# Altium schematic sheet MCU.SchDoc
size A4; SheetNumber: 5; SheetTotal: 7
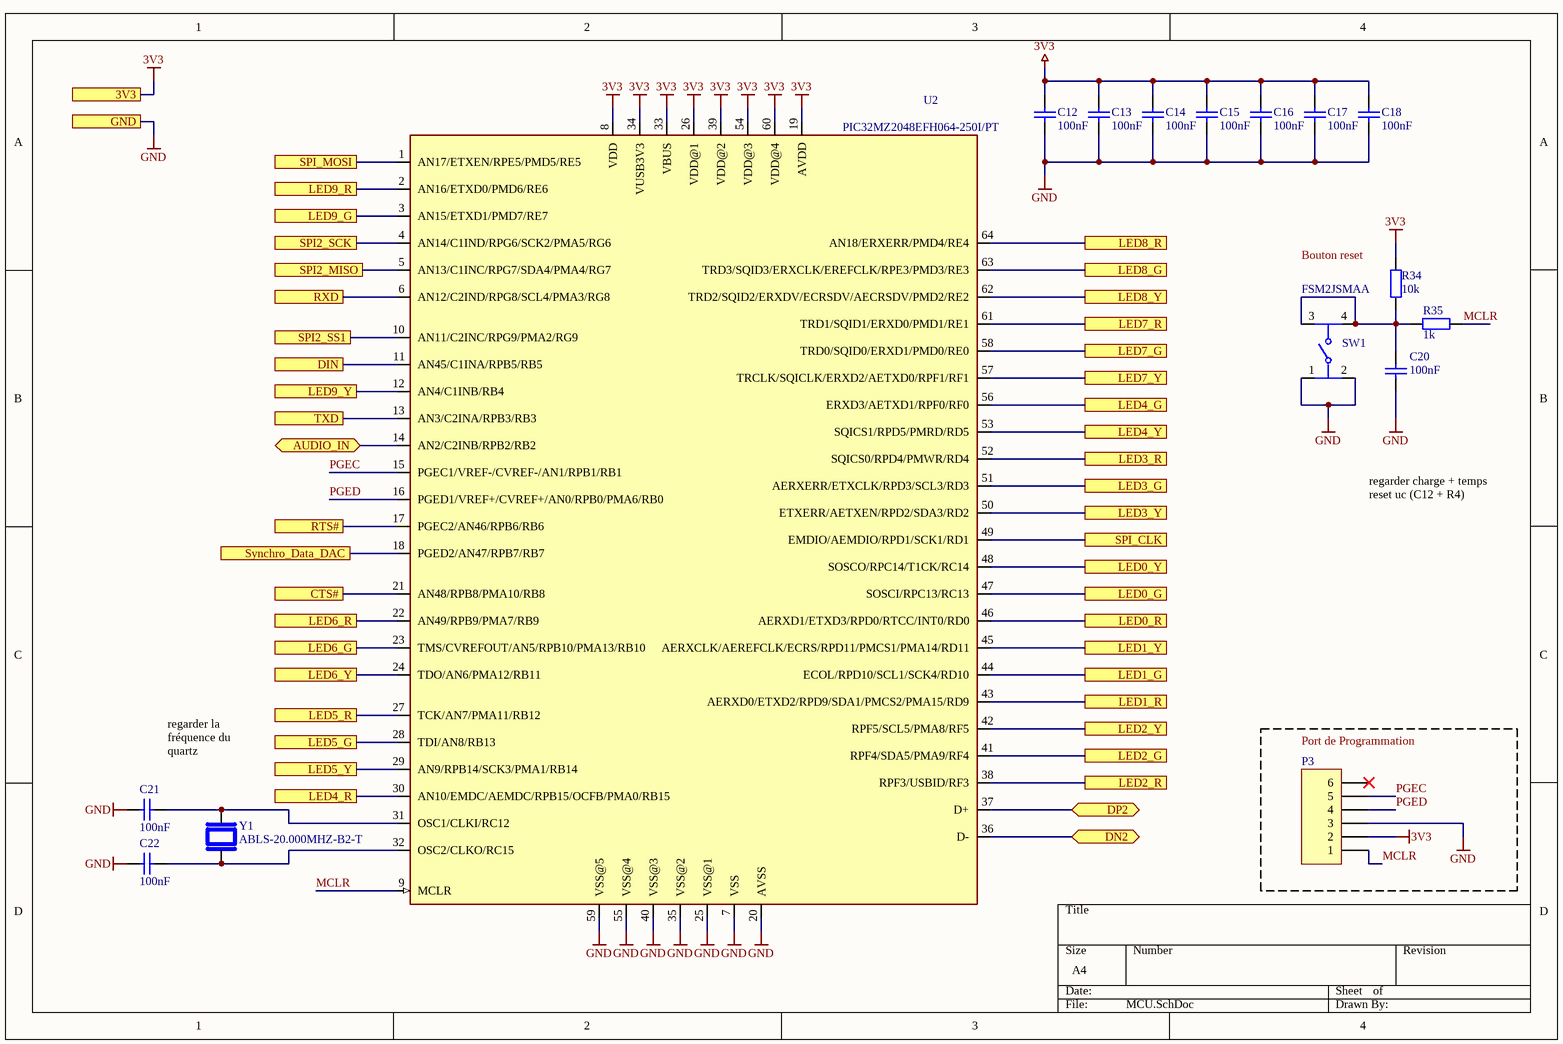
[diagram p0: MCU.SchDoc]

## Parts
C12  100nF  [C0805]
C13  100nF  [C0805]
C14  100nF  [C0805]
C15  100nF  [C0805]
C16  100nF  [C0805]
C17  100nF  [C0805]
C18  100nF  [C0805]
C20  100nF  [C0805]
C21  100nF  [C0805]
C22  100nF  [C0805]
P3  76384-406LF  [HDR1X6]  (value not drawn)
R34  10k  [RESC2012X06M]
R35  1k  [RESC2012X06M]
SW1  FSM2JSMAA  [FP-FSM2JSMAA-MFG]
U2  PIC32MZ2048EFH064-250I/PT  [QFP50P1200X1200X120-64N]
Y1  ABLS-20.000MHZ-B2-T  [XTAL_ABLS-20.000MHZ-B2-T]

## Blocks framed on the sheet
Port de Programmation: P3

## Ports
3V3, AUDIO_IN (bidir), CTS#, DIN, DN2 (bidir), DP2 (bidir), GND, LED0_G, LED0_R, LED0_Y, LED1_G, LED1_R, LED1_Y, LED2_G, LED2_R, LED2_Y, LED3_G, LED3_R, LED3_Y, LED4_G, LED4_R, LED4_Y, LED5_G, LED5_R, LED5_Y, LED6_G, LED6_R, LED6_Y, LED7_G, LED7_R, LED7_Y, LED8_G, LED8_R, LED8_Y, LED9_G, LED9_R, LED9_Y, RTS#, RXD, SPI2_MISO, SPI2_SCK, SPI2_SS1, SPI_CLK, SPI_MOSI, Synchro_Data_DAC, TXD

## Nets
3V3: C12.1 C13.1 C14.1 C15.1 C16.1 C17.1 C18.1 P3.2 R34.1 U2.8(VDD) U2.19(AVDD) U2.26(VDD@1) U2.33(VBUS) U2.34(VUSB3V3) U2.39(VDD@2) U2.54(VDD@3) U2.60(VDD@4) ; port 3V3
GND: C12.2 C13.2 C14.2 C15.2 C16.2 C17.2 C18.2 C20.1 C21.2 C22.2 P3.3 SW1.1 SW1.2 U2.7(VSS) U2.20(AVSS) U2.25(VSS@1) U2.35(VSS@2) U2.40(VSS@3) U2.55(VSS@4) U2.59(VSS@5) ; port GND
AUDIO_IN: U2.14(AN2/C2INB/RPB2/RB2) ; port AUDIO_IN
CTS#: U2.21(AN48/RPB8/PMA10/RB8) ; port CTS#
DIN: U2.11(AN45/C1INA/RPB5/RB5) ; port DIN
DN2: U2.36(D-) ; port DN2
DP2: U2.37(D+) ; port DP2
LED0_G: U2.47(SOSCI/RPC13/RC13) ; port LED0_G
LED0_R: U2.46(AERXD1/ETXD3/RPD0/RTCC/INT0/RD0) ; port LED0_R
LED0_Y: U2.48(SOSCO/RPC14/T1CK/RC14) ; port LED0_Y
LED1_G: U2.44(ECOL/RPD10/SCL1/SCK4/RD10) ; port LED1_G
LED1_R: U2.43(AERXD0/ETXD2/RPD9/SDA1/PMCS2/PMA15/RD9) ; port LED1_R
LED1_Y: U2.45(AERXCLK/AEREFCLK/ECRS/RPD11/PMCS1/PMA14/RD11) ; port LED1_Y
LED2_G: U2.41(RPF4/SDA5/PMA9/RF4) ; port LED2_G
LED2_R: U2.38(RPF3/USBID/RF3) ; port LED2_R
LED2_Y: U2.42(RPF5/SCL5/PMA8/RF5) ; port LED2_Y
LED3_G: U2.51(AERXERR/ETXCLK/RPD3/SCL3/RD3) ; port LED3_G
LED3_R: U2.52(SQICS0/RPD4/PMWR/RD4) ; port LED3_R
LED3_Y: U2.50(ETXERR/AETXEN/RPD2/SDA3/RD2) ; port LED3_Y
LED4_G: U2.56(ERXD3/AETXD1/RPF0/RF0) ; port LED4_G
LED4_R: U2.30(AN10/EMDC/AEMDC/RPB15/OCFB/PMA0/RB15) ; port LED4_R
LED4_Y: U2.53(SQICS1/RPD5/PMRD/RD5) ; port LED4_Y
LED5_G: U2.28(TDI/AN8/RB13) ; port LED5_G
LED5_R: U2.27(TCK/AN7/PMA11/RB12) ; port LED5_R
LED5_Y: U2.29(AN9/RPB14/SCK3/PMA1/RB14) ; port LED5_Y
LED6_G: U2.23(TMS/CVREFOUT/AN5/RPB10/PMA13/RB10) ; port LED6_G
LED6_R: U2.22(AN49/RPB9/PMA7/RB9) ; port LED6_R
LED6_Y: U2.24(TDO/AN6/PMA12/RB11) ; port LED6_Y
LED7_G: U2.58(TRD0/SQID0/ERXD1/PMD0/RE0) ; port LED7_G
LED7_R: U2.61(TRD1/SQID1/ERXD0/PMD1/RE1) ; port LED7_R
LED7_Y: U2.57(TRCLK/SQICLK/ERXD2/AETXD0/RPF1/RF1) ; port LED7_Y
LED8_G: U2.63(TRD3/SQID3/ERXCLK/EREFCLK/RPE3/PMD3/RE3) ; port LED8_G
LED8_R: U2.64(AN18/ERXERR/PMD4/RE4) ; port LED8_R
LED8_Y: U2.62(TRD2/SQID2/ERXDV/ECRSDV/AECRSDV/PMD2/RE2) ; port LED8_Y
LED9_G: U2.3(AN15/ETXD1/PMD7/RE7) ; port LED9_G
LED9_R: U2.2(AN16/ETXD0/PMD6/RE6) ; port LED9_R
LED9_Y: U2.12(AN4/C1INB/RB4) ; port LED9_Y
MCLR: P3.1 R35.1 U2.9(MCLR)
PGEC: P3.5 U2.15(PGEC1/VREF-/CVREF-/AN1/RPB1/RB1)
PGED: P3.4 U2.16(PGED1/VREF+/CVREF+/AN0/RPB0/PMA6/RB0)
RTS#: U2.17(PGEC2/AN46/RPB6/RB6) ; port RTS#
RXD: U2.6(AN12/C2IND/RPG8/SCL4/PMA3/RG8) ; port RXD
SPI2_MISO: U2.5(AN13/C1INC/RPG7/SDA4/PMA4/RG7) ; port SPI2_MISO
SPI2_SCK: U2.4(AN14/C1IND/RPG6/SCK2/PMA5/RG6) ; port SPI2_SCK
SPI2_SS1: U2.10(AN11/C2INC/RPG9/PMA2/RG9) ; port SPI2_SS1
SPI_CLK: U2.49(EMDIO/AEMDIO/RPD1/SCK1/RD1) ; port SPI_CLK
SPI_MOSI: U2.1(AN17/ETXEN/RPE5/PMD5/RE5) ; port SPI_MOSI
Synchro_Data_DAC: U2.18(PGED2/AN47/RPB7/RB7) ; port Synchro_Data_DAC
TXD: U2.13(AN3/C2INA/RPB3/RB3) ; port TXD
NetC20_2: C20.2 R34.2 R35.2 SW1.3 SW1.4
NetC21_1: C21.1 U2.31(OSC1/CLKI/RC12) Y1.2
NetC22_1: C22.1 U2.32(OSC2/CLKO/RC15) Y1.1

Not connected (* = marked no-connect by the designer): P3 6*

## Notes on the sheet
- (near R34) Bouton reset
- regarder charge + temps reset uc (C12 + R4)
- regarder la fréquence du quartz

## Library data of the parts
C12-C18 = Cap: Capacitor; Published: 8-Jun-2000; LatestRevisionDate: 17-Jul-2002; LatestRevisionNote: Re-released for DXP Platform.; PackageReference: RAD-0.3; Publisher: Altium Limited; PackageDescription: Radial Cap, Thru-Hole; 2 Leads; 0.3 in Pin Spacing; Value: 100nF
C20-C22 = Cap: 10nf; Published: 8-Jun-2000; LatestRevisionDate: 17-Jul-2002; LatestRevisionNote: Re-released for DXP Platform.; PackageReference: RAD-0.3; Publisher: Altium Limited; PackageDescription: Radial Cap, Thru-Hole; 2 Leads; 0.3 in Pin Spacing; Value: 100nF
P3 = Header 6: Header, 6-Pin; LatestRevisionDate: 17-Jul-2002; LatestRevisionNote: Re-released for DXP Platform.; Publisher: Altium Limited
R34 R35 = Res2: Resistor; Published: 8-Jun-2000; LatestRevisionDate: 17-Jul-2002; LatestRevisionNote: Re-released for DXP Platform.; PackageReference: AXIAL-0.4; Publisher: Altium Limited; PackageDescription: Axial Device, Thru-Hole; 2 Leads; 0.4 in Pin Spacing
  R34: Value: 10k
  R35: Value: 1k
SW1 = CMP-03402-000003-1: SWITCH TACTILE SPST-NO 0.05A 24V; Manufacturer: TE Connectivity; Standoff Height: 0.05mm; Contact Current Rating: 50mA; Electromechanical Life: 100000Cycles; Operating Force: 260gf; Contact Resistance: 100mΩ; Package: 0; Temperature Range High: +85°C; Temperature: -35°C to +85°C; Category: Switch; Manufacturer Part Number: FSM2JSMAA; RoHS: TRUE; Mouser Description: Tactile Switches TACTILE 260G FORCE S; Device Class L1: Electromechanical; Mount: Surface Mount; Height: 4.59mm; ComponentLink2URL: https://www.te.com/commerce/DocumentDelivery/DDEController?Action=showdoc&DocId=Customer+Drawing%7F2-1437565-7%7FV%7Fpdf%7FEnglish%7FENG_CD_2-1437565-7_V.pdf%7F2-1437565-8; Temperature Range Low: -35°C; Voltage Rating Dc: 24V; Lead Free: Yes; Automotive: No; Throw Configuration: SPST-NO; Octopart: https://octopart.com/fsm2jsmaa-te+connectivity-41720620; Device Class L2: Switches; Device Class L3: Pushbutton Switches; ComponentLink2Description: Datasheet; Digikey Description: SWITCH TACTILE SPST-NO 0.05A 24V
U2 = PIC32MZ2048EFH064-250I/PT: MIPS32Â® M-Class PICÂ® 32MZ Microcontroller IC 32-Bit 250MHz 2MB _2M x 8_ FLASH 64-TQFP _10x10_; MF: Microchip; MP: PIC32MZ2048EFH064-250I/PT; SnapEDA_Link: https://www.snapeda.com/parts/PIC32MZ2048EFH064-250I/PT/Microchip/view-part/1145914/?ref=snap; Digi-Key_Purchase_URL: https://www.digikey.com/product-detail/en/microchip-technology/PIC32MZ2048EFH064-250I-PT/PIC32MZ2048EFH064-250I-PT-ND/6152256?utm_source=snapeda&utm_medium=aggregator&utm_campaign=symbol; Value: *; Package: TQFP-64 Microchip; Digi-Key_Part_Number: PIC32MZ2048EFH064-250I/PT-ND
Y1 = ABLS-20.000MHZ-B2-T: HC/49US (AT49) SMD LOW PROFILE CRYSTAL; MF: Abracon LLC; Availability: In Stock; SnapEDA_Link: https://www.snapeda.com/parts/ABLS-20.000MHZ-B2-T/Abracon+LLC/view-part/?ref=snap; Check_prices: https://www.snapeda.com/parts/ABLS-20.000MHZ-B2-T/Abracon+LLC/view-part/?ref=eda; Price: None; Package: HC-49/US Abracon LLC; Purchase-URL: https://pricing.snapeda.com/search/part/ABLS-20.000MHZ-B2-T/?ref=eda; MP: ABLS-20.000MHZ-B2-T; Value: *